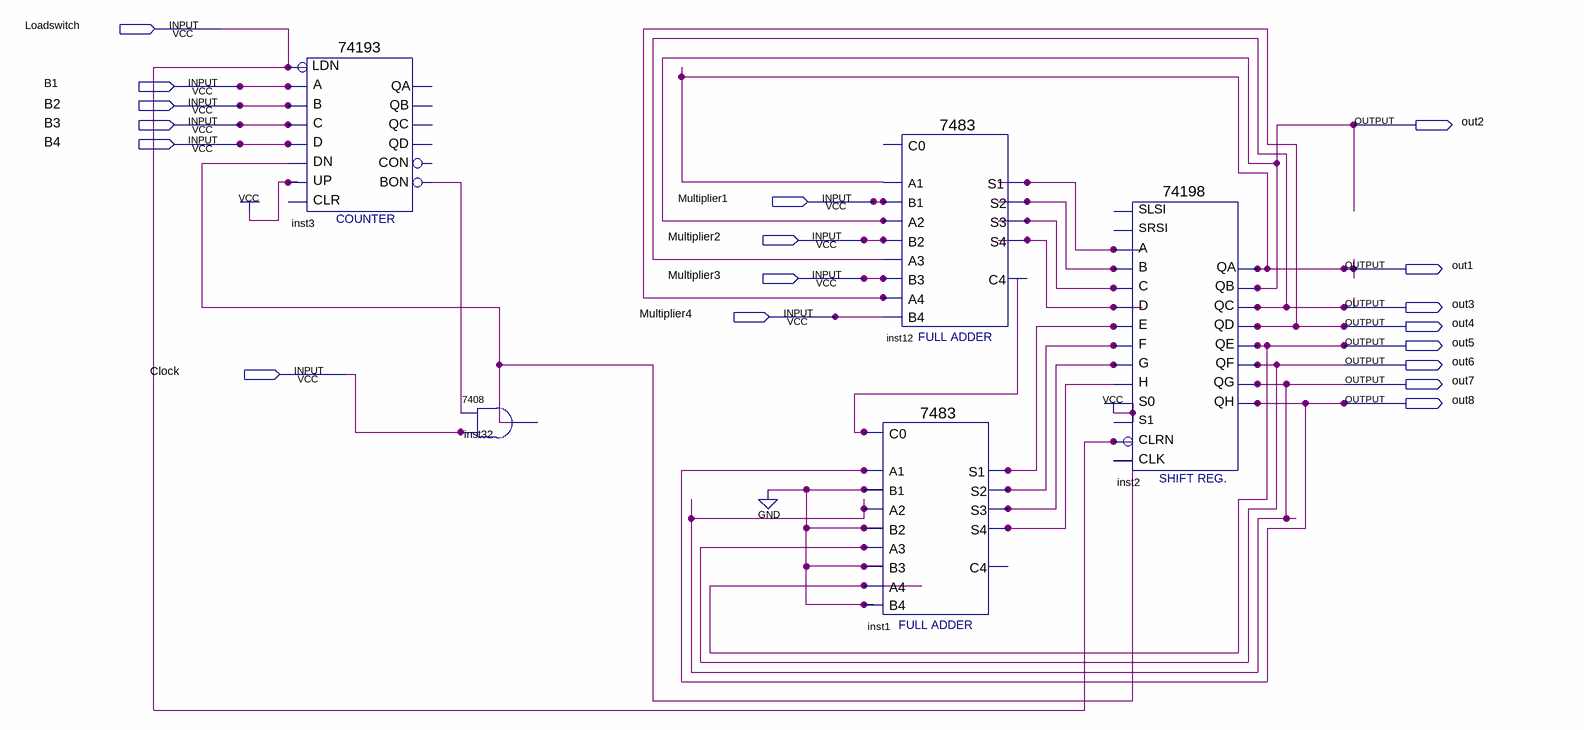
[diagram p0: schematic sheet]
// Quartus schematic multiplier.bdf as structural Verilog: 5 symbols, 18 pins
module multiplier (
  input  Loadswitch,
  input  B1,
  input  B2,
  input  B3,
  input  B4,
  input  Multiplier1,
  input  Multiplier2,
  input  Multiplier3,
  input  Multiplier4,
  input  Clock,
  output out2,
  output out1,
  output out3,
  output out4,
  output out5,
  output out6,
  output out7,
  output out8
);

  wire inst1_s1, inst1_s2, inst1_s3, inst1_s4, inst3_bon, inst12_c4, inst12_s1, inst12_s2, inst12_s3,
       inst12_s4, inst32_1;

  \74193  inst3 (
    .D(B4), .C(B3), .B(B2), .A(B1), .UP(1'b1), .DN(inst32_1), .LDN(Loadswitch), .BON(inst3_bon));  // open: CLR, QB, QA, CON, QD, QC
  \7408  inst32 (.\3 (Clock), .\2 (inst3_bon), .\1 (inst32_1));
  \7483  inst12 (
    .B4(Multiplier4), .A1(out1), .A2(out2), .B1(Multiplier1), .B2(Multiplier2), .A3(out3), .B3(Multiplier3),
    .A4(out4), .S3(inst12_s3), .S4(inst12_s4), .S2(inst12_s2), .C4(inst12_c4), .S1(inst12_s1));  // open: C0
  \7483  inst1 (
    .B4(1'b0), .C0(inst12_c4), .A1(out8), .A2(out7), .B1(1'b0), .B2(1'b0), .A3(out6), .B3(1'b0), .A4(out5),
    .S3(inst1_s3), .S4(inst1_s4), .S2(inst1_s2), .S1(inst1_s1));  // open: C4
  \74198  inst2 (
    .A(inst12_s1), .E(inst1_s1), .S0(1'b1), .B(inst12_s2), .C(inst12_s3), .D(inst12_s4), .H(inst1_s4),
    .G(inst1_s3), .CLRN(Loadswitch), .CLK(inst32_1), .F(inst1_s2), .S1(1'b1), .QD(out4), .QC(out3),
    .QH(out8), .QA(out1), .QB(out2), .QE(out5), .QF(out6), .QG(out7));  // open: SRSI, SLSI
endmodule
